# Altium project AIBOT.PrjPcb
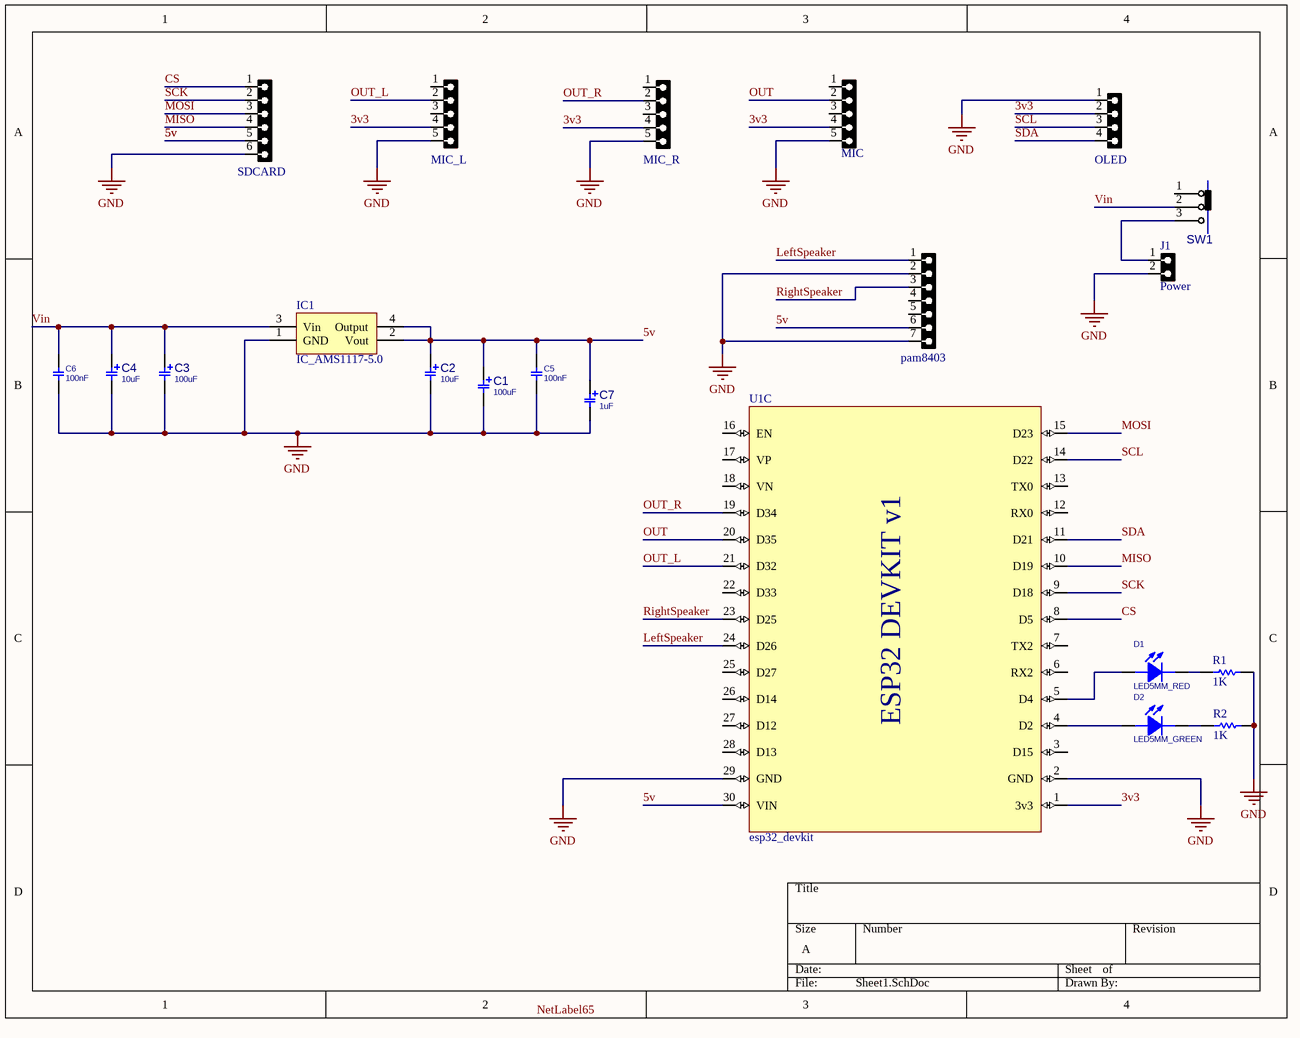
[diagram p0: Sheet1.SchDoc]
1 sheet, 21 parts. Net scope: global (net labels, ports and power ports of the same name join across sheets).
Board file: PCB1.PcbDoc

## Sheet Sheet1.SchDoc
size A

### Parts
C1  100uF  [C_EL_4X7]
C2  10uF  [C_EL_4X7]
C3  100uF  [C_EL_4X7]
C4  10uF  [C_EL_4X7]
C5  100nF  [C_CER_D3]
C6  100nF  [C_CER_D3]
C7  1uF  [C_EL_4X7]
D1  LED5MM_RED  [LED5MM_RED]
D2  LED5MM_GREEN  [LED5MM_GRN]
IC1  IC_AMS1117-5.0  [SOT223-4N]
J1  Power  [HDR_F_1X2]
MIC  HDRF5  [HDR_F_1X5]  (value not drawn)
MIC_L  HDRF5  [HDR_F_1X5]  (value not drawn)
MIC_R  HDRF5  [HDR_F_1X5]  (value not drawn)
OLED  HDRF4  [HDR_F_1X4]  (value not drawn)
pam8403  HDRF7  [HDR_F_1X7]  (value not drawn)
R1  1K  [Axial 0_5W 5_0mm]
R2  1K  [Axial 0_5W 5_0mm]
SDCARD  HDRF6  [HDR_F_1X6]  (value not drawn)
SW1  SlideSwitch  [SWSLIDT_SPDT_S_8X4]  (value not drawn)
U1  esp32_devkit  [esp32_devkit]  (part C of 3)

### Nets
GND: C1.2 C2.2 C3.2 C4.2 C5.1 C6.1 C7.2 IC1.1(GND) J1.2 MIC.5 MIC_L.5 MIC_R.5 OLED.1 pam8403.2 pam8403.7 R1.2 R2.2 SDCARD.6 U1.2(GND) U1.29(GND)
3v3: MIC.4 MIC_L.4 MIC_R.4 OLED.2 U1.1(3v3)
5v: C1.1 C2.1 C5.2 C7.1 IC1.2(Vout) IC1.4(Output) pam8403.6 SDCARD.5 U1.30(VIN)
CS: SDCARD.1 U1.8(D5)
LeftSpeaker: pam8403.1 U1.24(D26)
MISO: SDCARD.4 U1.10(D19)
MOSI: SDCARD.3 U1.15(D23)
OUT: MIC.2 U1.20(D35)
OUT_L: MIC_L.2 U1.21(D32)
OUT_R: MIC_R.2 U1.19(D34)
RightSpeaker: pam8403.3 U1.23(D25)
SCK: SDCARD.2 U1.9(D18)
SCL: OLED.3 U1.14(D22)
SDA: OLED.4 U1.11(D21)
Vin: C3.1 C4.1 C6.2 IC1.3(Vin) SW1.2(P3)
NetD1_1: D1.1(ANODE) U1.5(D4)
NetD1_2: D1.2(CATHODE) R1.1
NetD2_1: D2.1(ANODE) U1.4(D2)
NetD2_2: D2.2(CATHODE) R2.1
NetJ1_1: J1.1 SW1.3(P4)

Not connected (* = marked no-connect by the designer): MIC 1 3; MIC_L 1 3; MIC_R 1 3; pam8403 4 5; SW1 1(P1); U1 3(D15) 6(RX2) 7(TX2) 12(RX0) 13(TX0) 16(EN) 17(VP) 18(VN) 22(D33) 25(D27) 26(D14) 27(D12) 28(D13)

### Notes on the sheet
- Labels drawn without touching a wire or pin: NetLabel65
- (in symbol esp32_devkit, part C) ESP32 DEVKIT v1

### Library data of the parts
C1-C4 C7 = CAP_THD_EL_4X7: CAP, THD, ELEC,; MANF_P#: MANF_PART#; PARAM2: 25V; DESC: DESCRIPTION; DIST#: MOUSER; PARAM: 20%; PRICE: 10= 5$; MANF: MANF; ASSEMBLY: ASSEMBLY
  C1 C3: VALUE: 100uF
  C2 C4: VALUE: 10uF
  C7: VALUE: 1uF
C5 C6 = CAP_THD_CERML: CAP, THD, CER MULTI LAYER,; DESC: CAP, CER MULTI LAYER,; MANF_P#: MANF_PART#; PARAM2: 50V; PRICE: 100= 1$; MANF: MANF; ASSEMBLY: ASSEMBLY; VALUE: 100nF
D1 D2 = LED5MM: LED LIGHTING; Designer: Abbas Basereh; Data: 16-12-2016; Link: *; Part.No: *
IC1 = IC_AMS1117-5.0: 800mA LOW DROPOUT VOLTAGE REGULATOR; Manufacturer: Advanced Monolithic Systems, Inc.; Company: SJ Libraries; Designer: Eng. Saeid Jorablo; ESD Sensetive: True/False; Code_IPC: SOT-223; ComponentLink1Description: Datasheet; ComponentLink1URL: http://www.advanced-monolithic.com/pdf/ds1117.pdf; ComponentLink2Description: Reference; ComponentLink2URL: http://www.advanced-monolithic.com/index.html; PackageDescription: SOT223, 4-Leads, Body 6.7x7.3mm (max), Pitch 2.30mm; PinCount: 4; Update: 6/5/2012; Category: Integrated Circuit; Status: Unrelease; HelpURL: http://s3.picofile.com/file/7443264187/Coming_Soon_logo.gif; Operating Temperature: -55 ~ +125 (C); Mounting Technology: Surface Mount; RoHS compliant: True/False
J1 = HDR_F_1X2: CONN, HEADER, Female, pitch: 2.54mm, 2POS; VALUE: HDRF2
MIC MIC_L MIC_R = HDR_F_1X5: CONN, HEADER, Female, pitch: 2.54mm, 5POS; VALUE: HDRF5
OLED = HDR_F_1X4: CONN, HEADER, Female, pitch: 2.54mm, 4POS; VALUE: HDRF4
pam8403 = HDR_F_1X7: CONN, HEADER, Female, pitch: 2.54mm, 7POS; VALUE: HDRF7
R1 R2 = RES Axial 0.5W: Designer: Abbas Basereh; Desc.: RES Axial 0.5W; Data: 4-1-2017
SDCARD = HDR_F_1X6: CONN, HEADER, Female, pitch: 2.54mm, 6POS; VALUE: HDRF6
SW1 = SWSLIDT_SPDT_S_8X4: SWITCH, SLIDE, SPDT, 8.6X4.3mm, THD; MANF_PART#: OS102011MS2QN1; MANF: C&K; DESC: DESCRIPTION; VALUE: SlideSwitch; ASSEMBLY: ASSEMBLY; PARAM: PARAM; PRICE: 0.4$